# EAGLE design receiver_and_power_min_version (EAGLE 9.2.2)
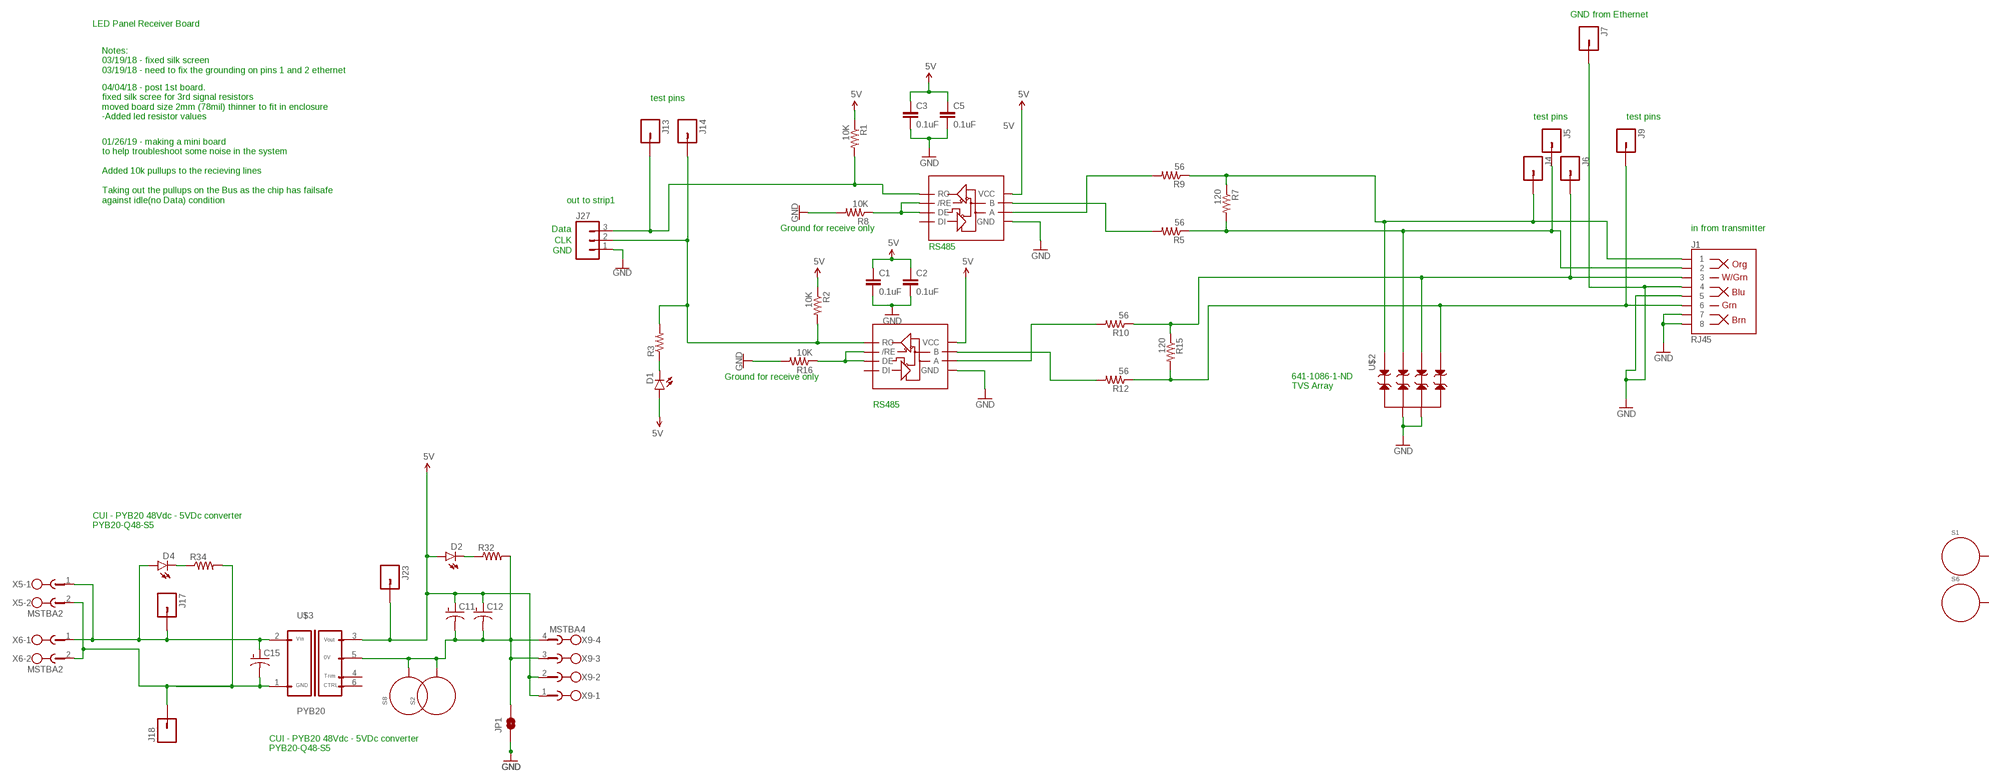
[diagram p0: schematic, sheet 1]

## Parts
C1  0.1uF  CAP0805  [0805]
C2  0.1uF  CAP0805  [0805]
C3  0.1uF  CAP0805  [0805]
C5  0.1uF  CAP0805  [0805]
C11  CAP_POLPTH4  [CPOL-RADIAL-1000UF-25V]
C12  CAP_POLPTH4  [CPOL-RADIAL-1000UF-25V]
C15  CAP_POLPTH4  [CPOL-RADIAL-1000UF-25V]
D1  LED3MM  [LED3MM]
D2  LED3MM  [LED3MM]
D4  LED3MM  [LED3MM]
J1  RJ45  RJ45-8  [RJ45-8]
J4  M01PTH  [1X01]
J5  M01PTH  [1X01]
J6  M01PTH  [1X01]
J7  M01PTH  [1X01]
J9  M01PTH  [1X01]
J13  M01PTH  [1X01]
J14  M01PTH  [1X01]
J17  M01PTH  [1X01]
J18  M01PTH  [1X01]
J23  M01PTH  [1X01]
J27  M03SCREW  [SCREWTERMINAL-3.5MM-3]
JP1  JUMPER-PAD-2-NC_BY_TRACE  [PAD-JUMPER-2-NC_BY_TRACE_YES_SILK]
R1  10K  RESISTOR0805-RES  [0805]
R2  10K  RESISTOR0805-RES  [0805]
R3  RESISTOR0805-RES  [0805]
R5  56  RESISTOR0805-RES  [0805]
R7  120  RESISTOR0805-RES  [0805]
R8  10K  RESISTOR0805-RES  [0805]
R9  56  RESISTOR0805-RES  [0805]
R10  56  RESISTOR0805-RES  [0805]
R12  56  RESISTOR0805-RES  [0805]
R15  120  RESISTOR0805-RES  [0805]
R16  10K  RESISTOR0805-RES  [0805]
R32  RESISTORPTH-1/4W  [AXIAL-0.4]
R34  RESISTORPTH-1/4W  [AXIAL-0.4]
S1  STANDOFF_ELECTRICAL5-32  [STANDOFF_ELECTRICAL_5_32]
S2  STANDOFF_ELECTRICAL5-32  [STANDOFF_ELECTRICAL_5_32]
S6  STANDOFF_ELECTRICAL5-32  [STANDOFF_ELECTRICAL_5_32]
S8  STANDOFF_ELECTRICAL5-32  [STANDOFF_ELECTRICAL_5_32]
U1  ST1480ACSOIC  [SO08]
U2  ST1480ACSOIC  [SO08]
U$2  TVS_ARRAY  [SOT26]
U$3  PYB20  [CUI_PYB20_PCB_DC_DC]
X5  MSTBA2  [MSTBA2]
X6  MSTBA2  [MSTBA2]
X9  MSTBA4  [MSTBA4]

## Nets
5GND1: C11.2(-) C12.2(-) JP1.2 R32.P$2 S2.P1 S8.P1 U$3.5(0V) X9.3 X9.4
5V: C1.1 C2.1 C3.1 C5.1 C11.1(+) C12.1(+) D1.A D2.A J23.1 R1.1 R2.1 U1.8(VCC) U2.8(VCC) U$3.3(V+) X9.1 X9.2
48GND: C15.- J18.1 R34.P$2 U$3.1(GND1) X5.2 X6.2
48V: C15.+ D4.A J17.1 U$3.2(VIN) X5.1 X6.1
A: R9.2 U1.6(A)
A1: R10.2 U2.6(A)
AO: J1.1 J4.1 R7.1 R9.1 U$2.1
AO1: J1.3 J6.1 R10.1 R15.1 U$2.4
B: R5.2 U1.7(B)
B1: R12.2 U2.7(B)
BO: J1.2 J5.1 R5.1 R7.2 U$2.3
BO1: J1.6 J9.1 R12.1 R15.2 U$2.6
DE: R8.1 U1.2(/RE) U1.3(DE)
DE1: R16.1 U2.2(/RE) U2.3(DE)
GND: C1.2 C2.2 C3.2 C5.2 J1.4 J1.5 J1.7 J1.8 J7.1 J27.1 JP1.1 R8.2 R16.2 U1.5(GND) U2.5(GND) U$2.2 U$2.5
N$2: D1.K(C) R3.1
N$3: D4.K(C) R34.P$1
N$12: D2.K(C) R32.P$1
RXD: J13.1 J27.3 R1.2 U1.1(RO)
RXD1: J14.1 J27.2 R2.2 R3.2 U2.1(RO)
Unconnected: S1.P1 S6.P1 U1.4(DI) U2.4(DI) U$3.4(TRIM) U$3.6(CTRL)

## Notes on the sheet
- GND from Ethernet
- LED Panel Receiver Board
- Notes:
  03/19/18 - fixed silk screen
  03/19/18 - need to fix the grounding on pins 1 and 2 ethernet
- test pins
- 04/04/18 - post 1st board.
  fixed silk scree for 3rd signal resistors
  moved board size 2mm (78mil) thinner to fit in enclosure
  -Added led resistor values
- test pins | test pins
- 01/26/19 - making a mini board
  to help troubleshoot some noise in the system
  
  Added 10k pullups to the recieving lines
  
  Taking out the pullups on the Bus as the chip has failsafe 
  against idle(no Data) condition
- out to strip1
- Data | Ground for receive only | in from transmitter
- CLK
- RS485
- GND
- Ground for receive only
- 641-1086-1-ND
  TVS Array
- RS485
- CUI - PYB20 48Vdc - 5VDc converter 
  PYB20-Q48-S5
- CUI - PYB20 48Vdc - 5VDc converter 
  PYB20-Q48-S5

## Library data of the parts
C1-C3 C5 = PatternAgents-ProtoPads:CAP: Capacitor Standard 0603 ceramic capacitor, and 0.1" leaded capacitor.
C11 C12 = SparkFun-Passives:CAP_POL: Capacitor Polarized These are standard SMD and PTH capacitors. Normally 10uF, 47uF, and 100uF in electrolytic and tantalum varieties. Always verify the external diameter of the through hole cap, it varies with capacity, voltage, and manufacturer. The EIA devices should be standard.
C15 = SparkFun-Capacitors:CAP_POL: Capacitor Polarized These are standard SMD and PTH capacitors. Normally 10uF, 47uF, and 100uF in electrolytic and tantalum varieties. Always verify the external diameter of the through hole cap, it varies with capacity, voltage, and manufacturer. The EIA devices should be standard.
D1 D2 D4 = SparkFun-LED:LED: LEDs Standard schematic elements and footprints for 5mm, 3mm, 1206, and 0603 sized LEDs. 5mm - Spark Fun Electronics SKU : COM-00529 (and others); PROD_ID: DIO-08794
J1 = SparkFun-Connectors:RJ45-8: RJ45 Jack - 8 pin Simple RJ45, 8-pin connection. Commonly used for Cat5, Cat5e, and Cat6 Ethernet cables. Here is the connector we sell at SparkFun: RJ45 8-Pin Connector <https://www.sparkfun.com/products/643> (PRT-00643) Datasheet <https://cdn.sparkfun.com/datasheets/Prototyping/04908.pdf> It is used on this SparkFun product: SparkFun RJ45 Breakout <https://www.sparkfun.com/products/716> (BOB-00716) Note, you may also be interested in the "MAGJACK" version of this. It is basically a RJ45 connector, but also has some status LEDs built into the connector housing. You can check that out in this library at the device named "MAGJACK.dev" and see these products online: RJ45 Ethernet MagJack-Compatible <https://www.sparkfun.com/products/8534> (PRT-08534) SparkFun RJ45 MagJack Breakout <https://www.sparkfun.com/products/13021> (BOB-13021); PROD_ID: CONN-08506; SF_ID: PRT-00643
J4-J7 J9 J13 J14 J17 J18 J23 = SparkFun-Connectors:M01: Header 1 Standard 1-pin 0.1" header. Use with straight break away headers (SKU : PRT-00116), right angle break away headers (PRT-00553), swiss pins (PRT-00743), machine pins (PRT-00117), and female headers (PRT-00115). SMTSO-256-ET is a "flush mount" nut for a 4-40 screw. The older package used to be too tight, and did not allow it to sit properly thru the drill hit. The latest (0.165DIA) fits nice and snug.
J27 = SparkFun-Connectors:M03: Header 3 Standard 3-pin 0.1" header. Use with straight break away headers (SKU : PRT-00116), right angle break away headers (PRT-00553), swiss pins (PRT-00743), machine pins (PRT-00117), and female headers (PRT-00115). Molex polarized connector foot print use with SKU : PRT-08232 with associated crimp pins and housings.; PROD_ID: CONN-08288
JP1 = SparkFun-Passives:JUMPER-PAD-2-NC_BY_TRACE
R1 R2 R5 R7-R10 R12 R15 R16 = PatternAgents-ProtoPads:RESISTOR: Resistor Basic schematic elements and footprints for 0603, 1206, and PTH resistors.
R3 R32 R34 = SparkFun-Passives:RESISTOR: Resistor Basic schematic elements and footprints for 0603, 1206, and PTH resistors.
S1 S2 S6 S8 = th_libraries:STANDOFF_ELECTRICAL: A standoff intended to be an electrically connected point. Pad size and stop size allow for a #8 Phillips pan screw head to make a solid connection to the board. Added 144mill drill hole that fits my normal wood screw
U1 U2 = TSOC-MODBUS-ESM:ST1480AC: ST Microelectronics ST1480AC RS-485/RS-422 Transceiver Source : http://www.st.com/web/en/resource/technical/document/datasheet/CD00003136.pdf The ST1480Ax is ±15 kV ESD protected, 3.3 V low power transceiver for RS-485 and RS-422 communications. The device contains one driver and one receiver in half duplex configuration. The ST1480Ax transmits and receives at a guaranteed data rate of at least 12 Mbps. All transmitter outputs and receiver inputs are protected to ±15 kV using Human Body Model. Driver is short-circuit current limited and is protected against excessive power dissipation by thermal shutdown circuitry that places the driver outputs into a high-impedance state. The ST1480Ax input has a true fail-safe feature that guarantees a logic high output if both inputs are open circuit, shorted together or in the presence of a termination with no signal on the bus.
U$2 = th_libraries:TVS_ARRAY
U$3 = th_libraries:PYB20: CUI - PYB20-Q48-S51, 4amps, 48VDC in, 5VDC out https://www.cui.com/product/resource/pyb20.pdf
X5 X6 = con-phoenix-508:MSTBA2: PHOENIX; MF: FARNELL; MPN: 1757242; OC_FARNELL: 3705171; OC_NEWARK: 71C4161
X9 = con-phoenix-508:MSTBA4: PHOENIX; MF: FARNELL; MPN: 1757268; OC_FARNELL: 3705195; OC_NEWARK: 71C4163

## Board
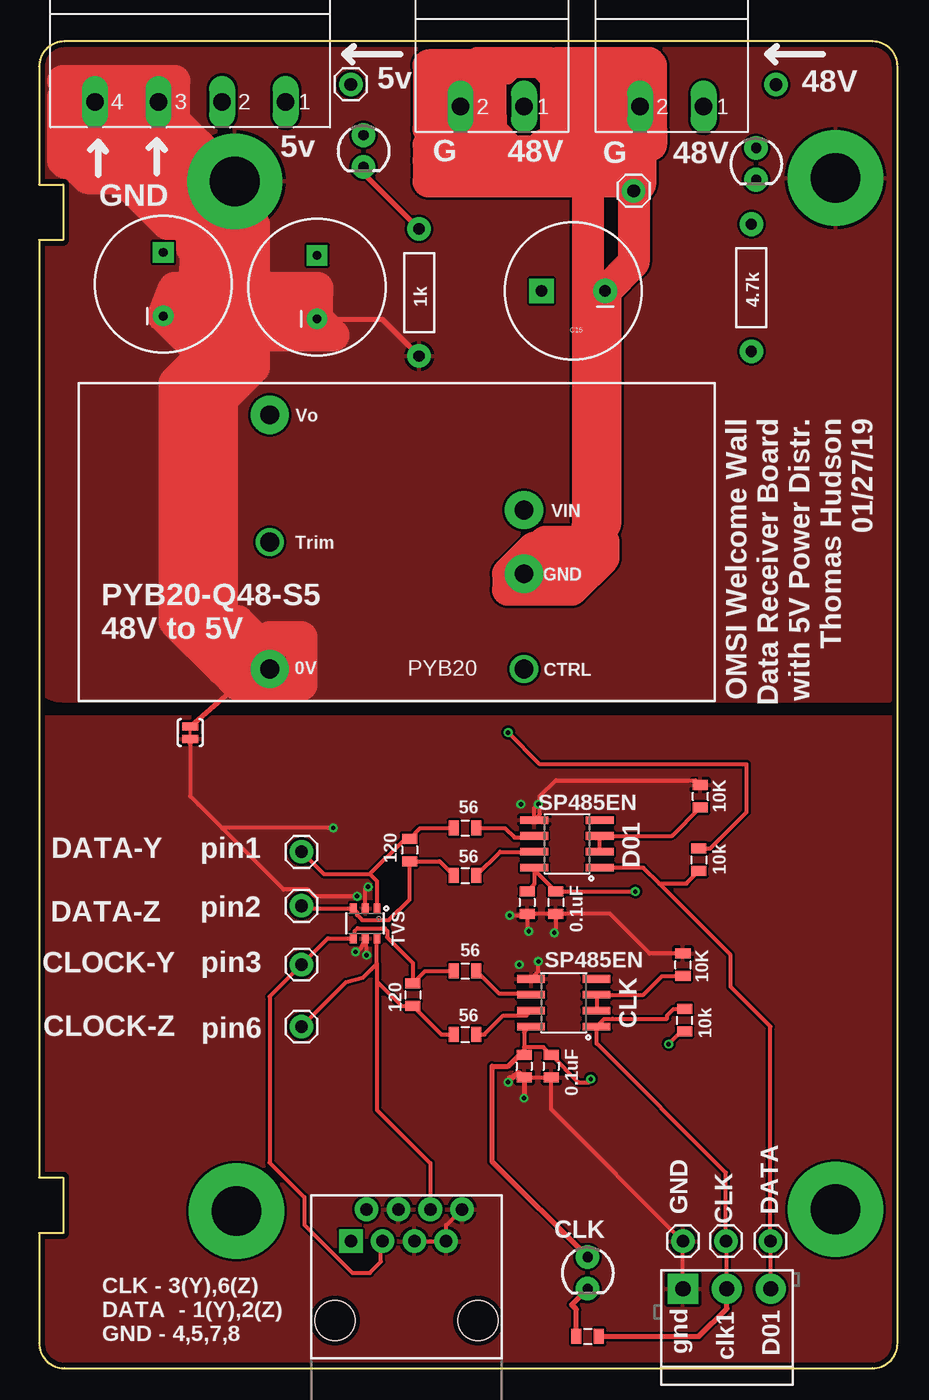
[diagram p1: board, top side]
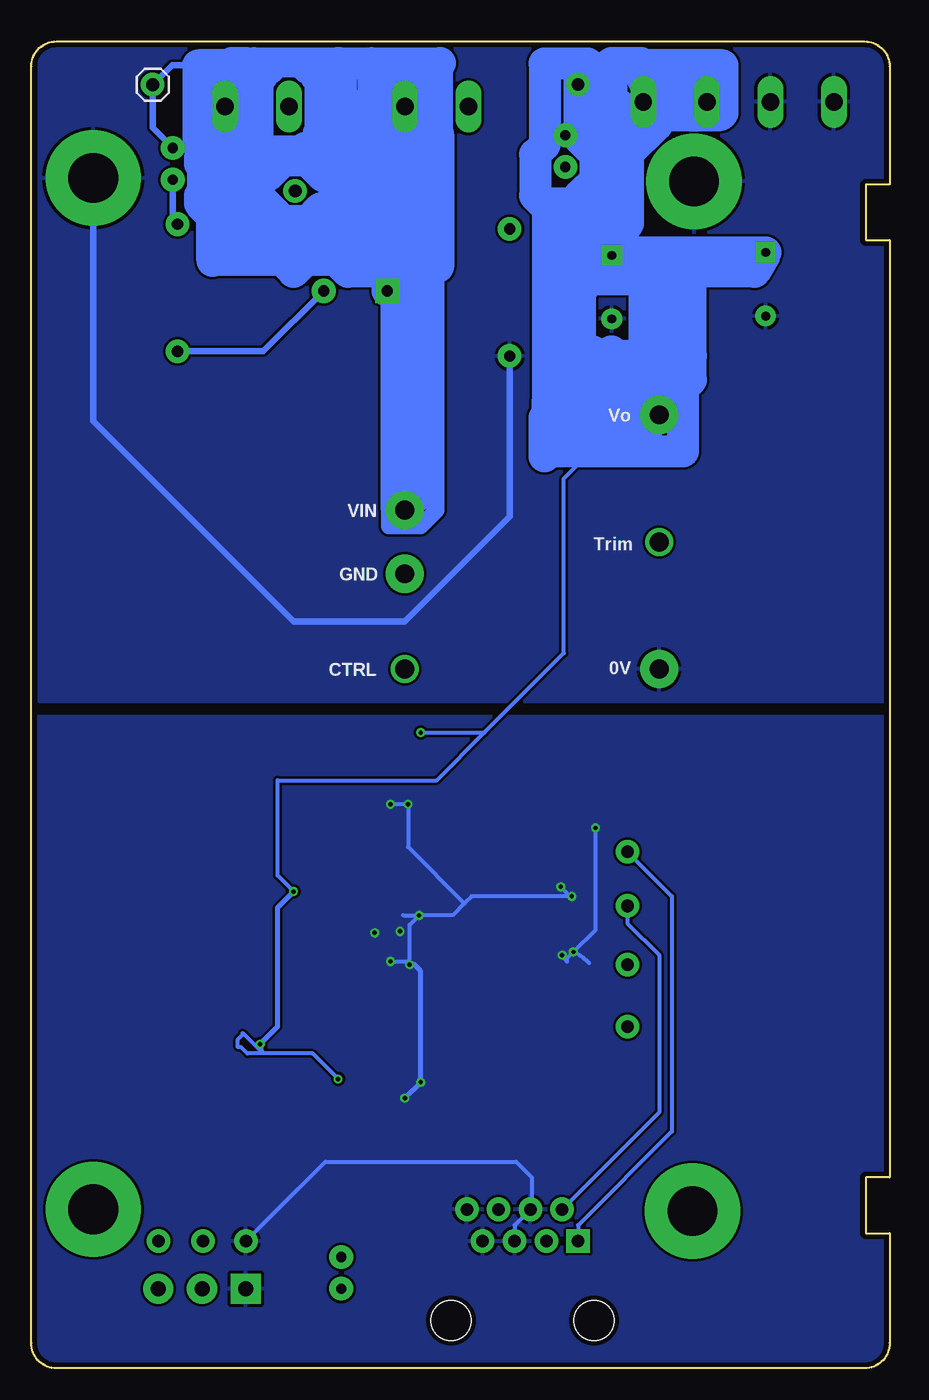
[diagram p2: board, bottom side, seen from below]

Size 68.58 x 106.05 mm. Coordinates in mm from the lower left corner, seen from the top.
Outline: 0,10.8 0,2 arc90 2,0 66.58,0 arc90 68.58,2 68.58,104.05 arc90 66.58,106.05 2,106.05 arc90 0,104.05 0,94.62 1.91,94.62 1.91,90.17 0,90.17 0,15.24 1.91,15.24 1.91,10.8 0,10.8
Copper layers (1*16): Top 0.0356mm / dielectric 1.5011mm / Bottom 0.0356mm
Design rules "oshpark-2layer *": minimum track width 12mil, minimum drill 13mil, track to track 8mil, track to pad 8mil, pad to pad 8mil, via to via 8mil, smd to smd 10mil, copper to edge 15mil, drill to drill 6mil, minimum pad ring 7mil, minimum via ring 7mil, stop-mask expansion 2.5mil, vias tented up to drill 35mil, thermal gap 10mil

### Footprints (pad centres in the part's own frame; a part is rotated, then mirrored left to right if it is on the bottom)
0805 = smd 0.8 x 1.2: 1 -0.9,0; 2 0.9,0
CPOL-RADIAL-1000UF-25V = drill 0.7 pad 1.651 square: 1 2.54,0 | drill 0.7 pad 1.651: 2 -2.54,0
CPOL-RADIAL-1000UF-25V' = drill 0.9 pad 1.93 square: + 2.54,0 | drill 0.9 pad 1.93: - -2.54,0
LED3MM = drill 0.813 pad 1.88: A -1.27,0; K 1.27,0
RJ45-8 = drill 1 pad 1.88 square: 1 -4.445,6.35 | drill 1 pad 1.88: 2 -3.175,8.89; 3 -1.905,6.35; 4 -0.635,8.89; 5 0.635,6.35; 6 1.905,8.89; 7 3.175,6.35; 8 4.445,8.89 | hole 3.2: -5.715,0; 5.715,0
1X01 = drill 1.016 pad 1.88: 1 0,0
SCREWTERMINAL-3.5MM-3 = drill 1.2 pad 2.413 square: 1 0,0 | drill 1.2 pad 2.413: 2 3.5,0; 3 7,0
PAD-JUMPER-2-NC_BY_TRACE_YES_SILK = smd 0.635 x 1.27: 1 -0.508,0; 2 0.508,0
AXIAL-0.4 = drill 0.9 pad 1.88: P$1 -5.08,0; P$2 5.08,0
STANDOFF_ELECTRICAL_5_32 = drill 3.969 pad 7.62: P1 0,0
SO08 = smd 0.61 x 2.21: 1 -1.905,-2.616; 2 -0.635,-2.616; 3 0.635,-2.616; 4 1.905,-2.616; 5 1.905,2.616; 6 0.635,2.616; 7 -0.635,2.616; 8 -1.905,2.616
SOT26 = smd 0.55 x 0.8: 1 -0.95,-1.2; 2 0,-1.2; 3 0.95,-1.2; 4 0.95,1.2; 5 0,1.2; 6 -0.95,1.2
CUI_PYB20_PCB_DC_DC = drill 1.499 pad 3.048: 1 0,0; 2 0,-5.08; 3 20.32,-12.7; 5 20.32,7.62 | drill 1.499 pad 2.184: 4 20.32,-2.54; 6 0,7.62
MSTBA2 = drill 1.397 long: 1 -2.54,5.08; 2 2.54,5.08
MSTBA4 = drill 1.397 long: 1 -7.62,5.08; 2 -2.54,5.08; 3 2.54,5.08; 4 7.62,5.08

### Placement (x,y rotation side)
C1  38.99,37.22 270 top
C2  38.73,24.13 270 top
C3  41.27,37.21 270 top
C5  40.89,24.14 270 top
C11  9.91,86.64 90 top
C12  22.2,86.41 90 top
C15  [CPOL-RADIAL-1000UF-25V']  42.67,86.11 180 top
D1  43.81,7.62 270 top
D2  25.91,97.28 270 top
D4  57.28,96.27 270 top
J1  29.34,3.81 0 top
J4  20.96,41.27 90 top
J5  20.96,36.96 90 top
J6  20.96,32.26 90 top
J7  51.43,10.16 180 top
J9  20.96,27.3 90 top
J13  58.42,10.16 180 top
J14  54.86,10.16 180 top
J17  58.88,102.59 0 bottom
J18  47.5,94.11 0 top
J23  24.89,102.62 0 top
J27  51.43,6.35 0 top
JP1  12.06,50.8 90 top
R1  52.7,40.64 270 top
R2  51.56,27.81 90 top
R3  43.81,2.54 0 top
R5  34.02,39.37 0 top
R7  29.59,41.41 270 top
R8  52.83,45.71 90 top
R9  34.02,43.18 0 top
R10  34.02,31.75 0 top
R12  34.02,26.67 0 top
R15  29.85,29.86 270 top
R16  51.43,32.25 90 top
R32  30.35,85.98 270 top
R34  56.9,86.36 270 top
S1  15.75,12.57 0 top
S2  15.62,94.87 0 top
S6  63.63,12.7 0 top
S8  63.63,95.12 0 top
U1  42.16,41.91 90 top
U2  41.91,29.21 90 top
U$2  26.04,35.56 180 top
U$3  38.73,63.5 180 top
X5  36.2,105.92 180 top
X6  50.55,105.92 180 top
X9  12.06,106.3 180 top

### Tracks (layer width: path | path; a pad name or v marks a point on that pad's centre or on a via)
5GND1
  Top 0.406: R32.P$2 27.43,83.82 22.15,83.82 | JP1.2 15.88,54.61
  Top 2.54: U$3.5 15.88,55.88 12.06,59.69 12.06,77.47 15.62,81.03 S2.P1 9.53,100.97 X9.3 5.71,101.22 5.33,101.6 1.91,101.6 1.91,96.52 | X9.4 3.17,99.95 3.17,99.06 8.26,99.06 9.53,97.79 10.79,97.79 | 13.33,95.25 10.79,97.79 | 13.33,95.25 13.33,93.98 12.06,93.98 8.26,97.79 3.17,97.79 | 3.17,97.79 3.17,96.52 6.98,96.52 10.79,92.71 12.06,92.71 14.61,90.17 14.61,83.82 | 14.61,81.28 14.61,83.82 | 14.61,81.28 13.33,81.28 | 13.33,81.28 10.79,78.74 10.79,59.69 14.61,55.88 | 14.61,55.88 15.88,57.15 14.61,58.42 | 14.61,58.42 13.33,59.69 13.33,77.47 | 13.33,77.47 13.33,80.01 14.61,81.28 | 14.61,77.47 14.61,81.28 | 14.61,77.47 17.15,80.01 17.15,82.55 | 17.15,82.55 17.15,91.44 13.33,95.25 | 10.79,97.79 10.79,102.87 1.91,102.87 3.17,101.6 3.17,97.79 | 3.17,97.79 1.91,96.52 | 14.61,55.88 15.88,54.61 20.96,54.61 20.96,58.42 18.42,58.42 18.42,57.15 15.88,59.69 | 13.33,81.28 12.72,81.28 C11.2 | C11.2 11.79,84.1 13.33,82.55 | 14.61,83.82 22.15,83.82 | 22.15,83.82 C12.2 22.2,83.85 23.5,82.55 17.15,82.55 | C11.2 10.79,86.36 22.23,86.36 22.15,83.82 | 1.91,96.52 2.08,96.34 2.62,96.34 3.84,95.12 6.6,95.12 10.25,91.48 11.34,91.48 12.21,90.62 12.21,89.52 12.45,89.28 12.45,87.88 12.95,87.38 12.95,84.46 | 14.61,58.42 14.61,77.47 | 13.33,77.47 14.61,77.47
  Bottom 0.508: R32.P$2 30.35,68.07 38.73,59.69 47.62,59.69 63.63,75.69 S8.P1
  pour Top (isolate 0): -0.64,106.68 67.95,106.68 67.95,53.34 1.91,53.34 arc-90 -0.64,55.88
  pour Bottom (isolate 0): -1.91,106.68 67.95,106.68 67.95,53.34 -0.64,53.34 arc-90 -1.91,54.61
5V  (via drill 0.35)
  Top 0.305: C1.1 39.55,38.68 U1.8 39.55,39.84 C3.1 41.29,38.1 v47.62,38.1 | U2.8 39.17,27.3 38.73,26.87 38.73,25.65 | 38.73,25.65 38.73,25.4 C2.1 | 38.73,25.65 40.28,25.65 C5.1 43.07,22.86 43.94,22.86 44.07,22.99 v44.07,23.11 | v50.29,25.91 51.3,26.91 R2.1 | R1.1 53.6,41.54 56.52,44.45 56.52,48.26 40,48.26 v37.46,50.8
  Top 0.406: D1.A 36.2,16.51 36.2,24.13 37.46,24.13 38.73,25.4
  Bottom 0.305: v44.07,23.11 46.1,25.15 51.31,25.15 51.82,25.65 52.07,25.65 52.07,26.29 51.69,26.67 51.69,26.8 50.29,25.4 50.16,25.4 50.16,25.78 v50.29,25.91 | v47.62,38.1 48.89,39.37 48.89,46.99 36.2,46.99 32.38,50.8 | 20.96,76.2 26.04,71.12 26.04,57.15 32.38,50.8 | v37.46,50.8 32.38,50.8
  Bottom 0.406: D2.A 24.13,100.33 22.23,100.33 22.23,101.6 | v50.29,25.91 48.89,27.3 48.89,36.83 v47.62,38.1 | 23.5,103.05 arc45 24.54,102.62 J23.1
  Bottom 1.27: 19.69,80.9 20.19,81.41 20.19,86.36 23.62,86.36 24.13,85.85 | 24.77,92.71 25.78,93.73 28.32,93.73
  Bottom 2.54: X9.1 X9.2 14.61,104.14 19.69,104.14 19.69,102.87 18.42,102.87 | 15.88,102.87 18.42,102.87 | 18.42,102.87 19.86,104.32 20.96,104.32 22.23,103.05 22.23,101.6 20.96,100.33 23.5,97.79 | 23.5,97.01 23.5,97.79 | U$3.3 20.96,78.74 | 20.96,78.74 23.5,78.74 | 24.77,78.74 23.5,78.74 | 23.5,78.74 20.96,76.2 | U$3.3 18.42,77.47 22.23,81.28 23.5,80.01 24.77,80.01 | 24.77,80.01 27.31,77.47 | 27.31,77.47 27.31,76.2 27.56,75.95 27.56,72.9 27.18,73.28 16.51,73.28 16.51,78.36 16.38,78.49 | 27.31,77.47 27.31,92.71 28.32,93.73 28.32,97.01 27.56,97.77 27.56,104.27 24.13,104.27 24,104.14 24.77,103.38 24.77,98.28 23.5,97.01 | 18.59,100.15 20.96,97.79 22.23,97.79 22.23,92.71 24.77,92.71 24.77,93.74 23.5,95.01 23.5,97.01 | 23.5,97.79 23.5,103.05 22.23,104.32 21.13,104.32 20.96,104.14 13.33,104.14 13.33,100.33 13.51,100.15 18.59,100.15 | 24.77,80.01 26.04,81.28 26.04,91.44 24.77,91.44 24.77,80.01 | U$3.3 19.69,74.93 19.69,73.66 20.96,73.66 24.77,77.47 27.31,74.93 23.5,74.93 23.5,76.2 19.69,80.01 | 18.59,100.15 18.59,99.37 20.9,97.06 20.9,91.49 20.96,91.44 22.23,91.44 | 22.23,91.44 23.5,91.44 | 22.23,91.44 22.2,91.42 C12.1 21.97,89.18 C11.1 10.79,87.63 15.88,87.63 | 15.88,87.63 23.5,87.63 | 20.96,78.74 16.64,78.74 16.38,78.49 | 16.38,78.49 15.88,78.99 15.88,80.9 | 15.88,80.9 18.42,80.9 | 18.42,80.9 19.69,80.9 23.37,80.9 23.75,81.28 | 15.88,80.9 15.88,87.63 | 18.42,80.9 18.42,86.23 18.03,86.61
48GND
  Top 1.27: 41.27,104.14 41.15,104.01 36.07,104.01 36.83,103.25 37.43,103.25 37.95,103.77 39.86,103.77 40.39,103.25 | 41.45,104.32 40.82,104.95 34.92,104.95
  Top 2.54: 48.01,94.62 X6.2 44.53,104.32 | 48.01,94.62 J18.1 | J18.1 47.5,88.39 C15.- 45.21,67.44 44.45,66.68 | 44.45,66.68 41.27,63.5 U$3.1 38.73,62.23 | 31.12,96.52 31.12,97.79 33.66,97.79 X5.2 33.66,102.87 32.38,101.6 32.38,99.06 31.12,99.06 31.12,104.14 34.92,104.14 34.92,99.06 36.07,100.2 | 31.12,96.52 34.92,96.52 | 34.92,97.79 34.92,96.52 | 34.92,96.52 41.27,96.52 42.54,97.79 42.54,101.6 43.81,102.87 43.81,96.52 | 43.81,96.52 45.09,96.52 46.35,97.79 45.09,99.06 45.09,101.6 46.35,101.6 48.89,99.06 | 48.89,99.06 48.89,97.79 | 48.89,99.06 48.89,104.14 48.72,104.32 44.53,104.32 | 44.53,104.32 41.45,104.32 41.27,104.14 41.27,97.79 40.3,97.79 39.78,97.27 37.69,97.27 36.07,98.89 36.07,100.2 | 38.73,62.23 42.54,62.23 45.09,64.77 45.09,66.04 40.43,66.04 39.98,65.58 39.55,65.58 37.46,63.5 37.46,62.23 38.73,62.23 | 43.81,96.52 43.81,67.31 44.45,66.68 | 31.12,96.52 31.12,94.87 47.75,94.87 48.01,94.62 | J18.1 47.5,95.38 46.48,96.39 46.48,100.58 | 36.07,100.2 36.07,104.01
  Bottom 0.508: R34.P$2 50.04,81.28 C15.-
48V
  Bottom 0.508: 55.24,104.14 57.33,104.14 J17.1 58.88,99.14 D4.A
  Bottom 1.27: 43.81,104.14 42.21,104.14 41.4,104.95 50.8,104.95 51.43,104.32 44.78,104.32 | 44.78,104.32 44.7,104.39 | 44.78,104.32 44.83,104.27 44.83,103.38 | 44.83,103.38 46.35,103.38 | 46.35,103.38 46.83,103.38 47.23,103.77 48.79,103.77 49.18,103.38 49.28,103.38 | 45.09,97.54 45.09,103.12 44.83,103.38 | 46.35,103.38 46.35,102.9 46.12,102.67 46.12,99.01 46.23,98.9 46.23,98.68 | 37.46,69.85 U$3.2 40,68.58 | 40,68.58 40,67.31 37.46,67.31 36.2,68.58 36.2,87.63 | 40,68.58 40,85.09
  Bottom 2.54: 51.43,102.49 X6.1 53.98,99.95 53.98,97.79 | 51.43,102.49 51.43,102.87 | 51.43,102.49 51.43,99.06 52.7,97.79 | 53.98,97.79 55.24,97.79 55.24,104.14 52.7,104.14 52.53,104.32 51.43,104.32 52.7,103.05 52.7,102.87 51.43,102.87 | 53.98,97.79 52.7,97.79 | 51.43,102.87 50.16,104.14 50.16,103.29 50.53,102.93 50.53,93.72 49.51,92.71 | 47.88,91.69 48.5,91.69 49.51,92.71 | 47.88,91.69 46.35,90.17 38.73,90.17 38.73,88.9 40,87.63 43.29,87.63 44.2,88.54 46.71,88.54 | X5.1 39.24,100.33 40,100.33 40,92.71 | 40,92.71 41.27,91.44 43.81,91.44 | 43.81,91.44 41.27,93.98 | 43.81,91.44 45.09,90.17 45.09,88.9 47.62,88.9 48.89,90.17 | 48.89,90.17 51.43,92.71 51.43,95.25 | 51.43,95.25 53.98,97.79 | 46.71,88.54 47.62,87.63 48.89,88.9 48.89,90.17 | 42.54,97.54 42.54,100.33 40,102.87 40,101.6 41.27,100.33 41.27,104.14 37.46,104.14 37.46,69.85 | 42.54,97.54 42.54,95.25 | 42.54,95.25 43.81,93.98 | 43.81,93.98 46.35,91.44 38.73,91.44 40,92.71 | 40,92.71 45.48,92.71 46.5,91.69 47.88,91.69 | 49.51,92.71 52.7,92.71 53.98,93.98 53.98,97.79 | C15.+ 40.13,86.23 38.73,87.63 U$3.2 | 43.81,93.98 43.81,104.14 43.99,104.32 | 43.99,104.32 44.07,104.32 | 43.99,104.32 35.94,104.32 36.18,104.08 36.18,98.75 36.07,98.64 36.07,88.01 | 46.71,88.54 54.08,88.54 54.1,88.52 54.1,95.76 55.12,96.77 55.12,96.25 54.86,96 54.86,94 55.12,93.74 55.12,93.09 50.93,88.9 | 42.54,97.54 45.09,97.54 46.7,97.54 46.96,97.27 52.18,97.27 52.7,97.79 | 42.54,95.25 45.23,95.25 46.5,96.52 48.5,96.52 49.77,95.25 51.43,95.25
A
  Top 0.305: R9.2 37.21,43.18 37.97,42.42 39.42,42.42 U1.6
A1
  Top 0.305: R10.2 36.7,29.97 39.17,29.97 U2.6
AO
  Top 0.305: J4.1 22.73,39.5 26.42,39.5 | U$2.1 26.99,38.93 26.42,39.5 | 26.42,39.5 29.23,42.31 R7.1 30.46,43.18 R9.1
  Bottom 0.305: J4.1 17.4,37.72 17.4,18.92 24.89,11.43 J1.1
AO1
  Top 0.305: R10.1 30.84,31.75 R15.1 29.85,32.38 27.79,34.44 27.79,34.98 27.61,35.17 25.41,35.17 25.23,34.98 25.23,34.5 U$2.4 23.06,34.36 J6.1 18.42,29.72 18.42,16.43 21.18,13.66 21.18,11.45 25.02,7.62 26.42,7.62 27.31,8.51 27.31,10.03 J1.3
B
  Top 0.305: R5.2 36.83,41.27 U1.7
B1
  Top 0.305: R12.2 35.56,26.67 37.08,28.19 38.91,28.19 U2.7
BO
  Top 0.305: J5.1 21.15,36.76 U$2.3 25.4,36.44 25.4,36.21 25.8,35.81 27.94,35.81 29.59,37.46 R7.2 31.98,40.51 R5.1
  Bottom 0.305: J5.1 20.96,35.56 18.42,33.02 18.42,20.45 J1.2
BO1
  Top 0.305: J9.1 24.51,30.86 25.91,31.24 26.99,32.32 | 26.99,32.32 U$2.6 | 26.99,32.32 26.99,30.93 | 26.99,30.93 28.96,28.96 R15.2 32.13,26.67 R12.1 | 26.99,30.93 26.99,20.64 31.24,16.38 J1.6
DE
  Top 0.305: U1.2 U1.3 50.57,42.55 R8.1
DE1
  Top 0.305: U2.2 U2.3 48.26,29.84 49.76,31.35 R16.1
GND  (via drill 0.35)
  Top 0.305: v37.59,36.2 38.86,36.2 C1.2 | U$2.2 26.04,38.24 v26.28,38.48 | v39.88,45.09 39.55,44.76 U1.5 40,44.27 40,45.72 41.27,46.99 52.45,46.99 R8.2 | J27.1 J7.1 40.89,20.7 C5.2 40.88,23.23 C2.2 | U2.5 39.88,31.7 v39.88,32.51 | C3.2 39,36.31 C1.2 | R16.2 48.77,33.15 45.6,36.31 C3.2 | v25.4,37.72 22.03,37.72 21.49,38.25 19.53,38.25 14.61,43.18 | 12.06,49.94 12.06,45.72 12.7,45.09 14.61,43.18 | C1.2 38.99,35.05 arc90 v39.12,34.92 | C3.2 41.27,34.92 arc-90 v41.15,34.8 | v25.27,33.27 arc43 25.4,33.27 25.68,33.55 U$2.5 v26.16,33.02 | J1.5 J1.7 32.51,11.43 J1.8 | v23.5,43.18 14.61,43.18
  Top 0.406: v38.73,21.59 C2.2 38.34,23.62 38.23,23.62 37.85,23.24 37.59,23.24 37.59,22.99 v37.46,22.86 | JP1.1 12.06,49.94
  Bottom 0.305: 33.97,37.15 33.4,37.72 v25.4,37.72 25.52,37.72 v26.28,38.48 | 33.97,37.15 34.92,36.2 v37.59,36.2 | 38.86,36.2 v37.59,36.2 | 33.97,37.15 38.48,41.66 v38.48,45.09 v39.88,45.09 | v37.59,36.2 38.35,35.43 v38.35,32.26 38.61,32.51 v39.88,32.51 | J7.1 45.09,16.51 29.85,16.51 28.58,15.24 28.58,12.83 J1.4 29.97,11.43 J1.5 | v25.27,33.27 arc23 24,32.38 | v26.16,33.02 25.78,32.51 25.78,32.77 v25.27,33.27 | v25.27,33.27 23.5,35.05 v23.5,43.18
  Bottom 0.406: v38.35,32.26 37.97,32.26 37.46,31.75 v37.46,22.86 v38.73,21.59
  pour Top (isolate 0): -0.64,52.07 70.48,52.07 arc90 69.22,50.8 69.22,-1.27 arc90 67.95,0 -0.64,0
  pour Bottom (isolate 0): -0.64,52.07 69.22,52.07 69.22,0 -0.64,0
N$2
  Top 0.406: R3.1 42.91,4.71 42.54,5.08 D1.K
N$3
  Bottom 0.508: D4.K 57.28,91.82 R34.P$1
N$12
  Top 0.406: R32.P$1 25.91,95.5 D2.K
RXD
  Top 0.305: 49.53,38.73 55.24,33.02 55.24,30.48 58.42,27.3 J13.1 58.43,10.14 J27.3 | 49.53,38.73 48.26,40.01 U1.1 | 49.53,38.73 51.7,38.73 R1.2
RXD1
  Top 0.305: J27.2 54.93,10.09 J14.1 54.86,15.62 44.53,25.96 U2.1 45.14,27.91 45.78,27.91 45.8,27.94 50.16,27.94 50.16,28.19 50.68,28.71 R2.2
  Top 0.406: R3.2 52.7,2.54 54.93,4.77 J27.2

### Text on the board
tPlace: 5v | 48V | 5v | G | 48V | G | 48V | GND | 4.7k | 1k | OMSI Welcome Wall / Data Receiver Board / with 5V Power Distr. / Thomas Hudson / 01/27/19 | PYB20-Q48-S5 / 48V to 5V | SP485EN | DATA-Y | pin1 | 10k | D01 | DATA-Z | pin2 | TVS | CLOCK-Y | pin3 | SP485EN | CLOCK-Z | pin6 | 10k | CLK | CLK | GND | DATA | CLK | clk1 | CLK - 3(Y),6(Z) / DATA - 1(Y),2(Z) / GND - 4,5,7,8 | gnd | D01